# EasyEDA Pro project ProProject_BPF-42_42-front-endpanel.epro

# Board PCB1
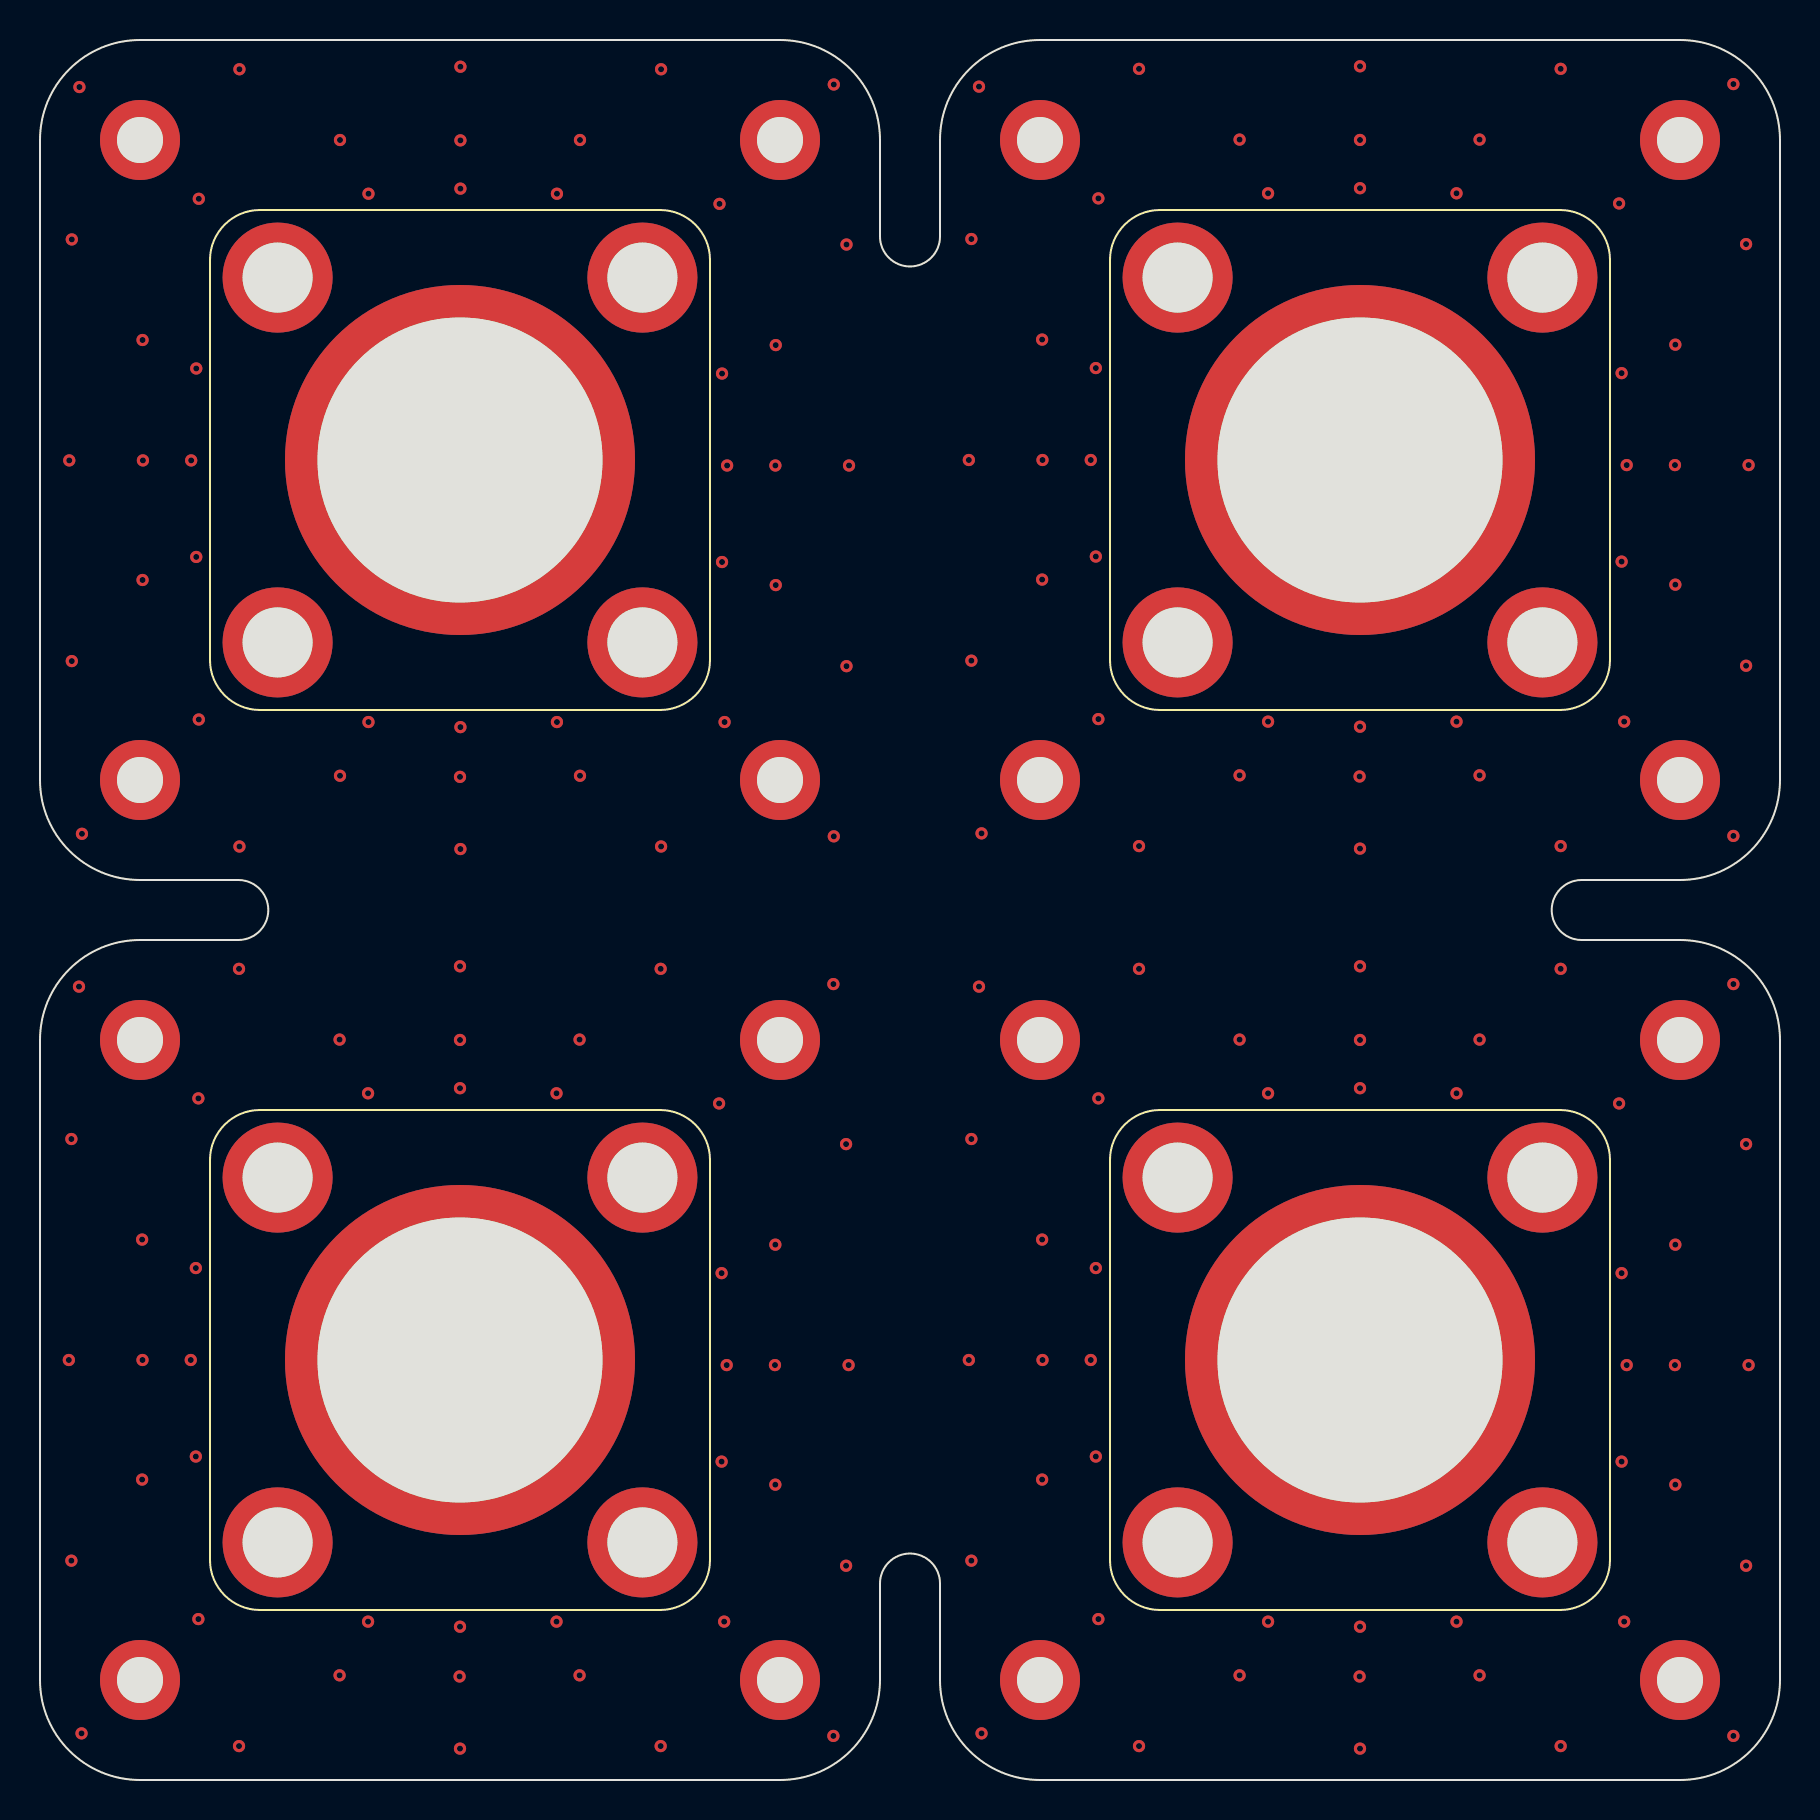
[diagram p0: board, top side]
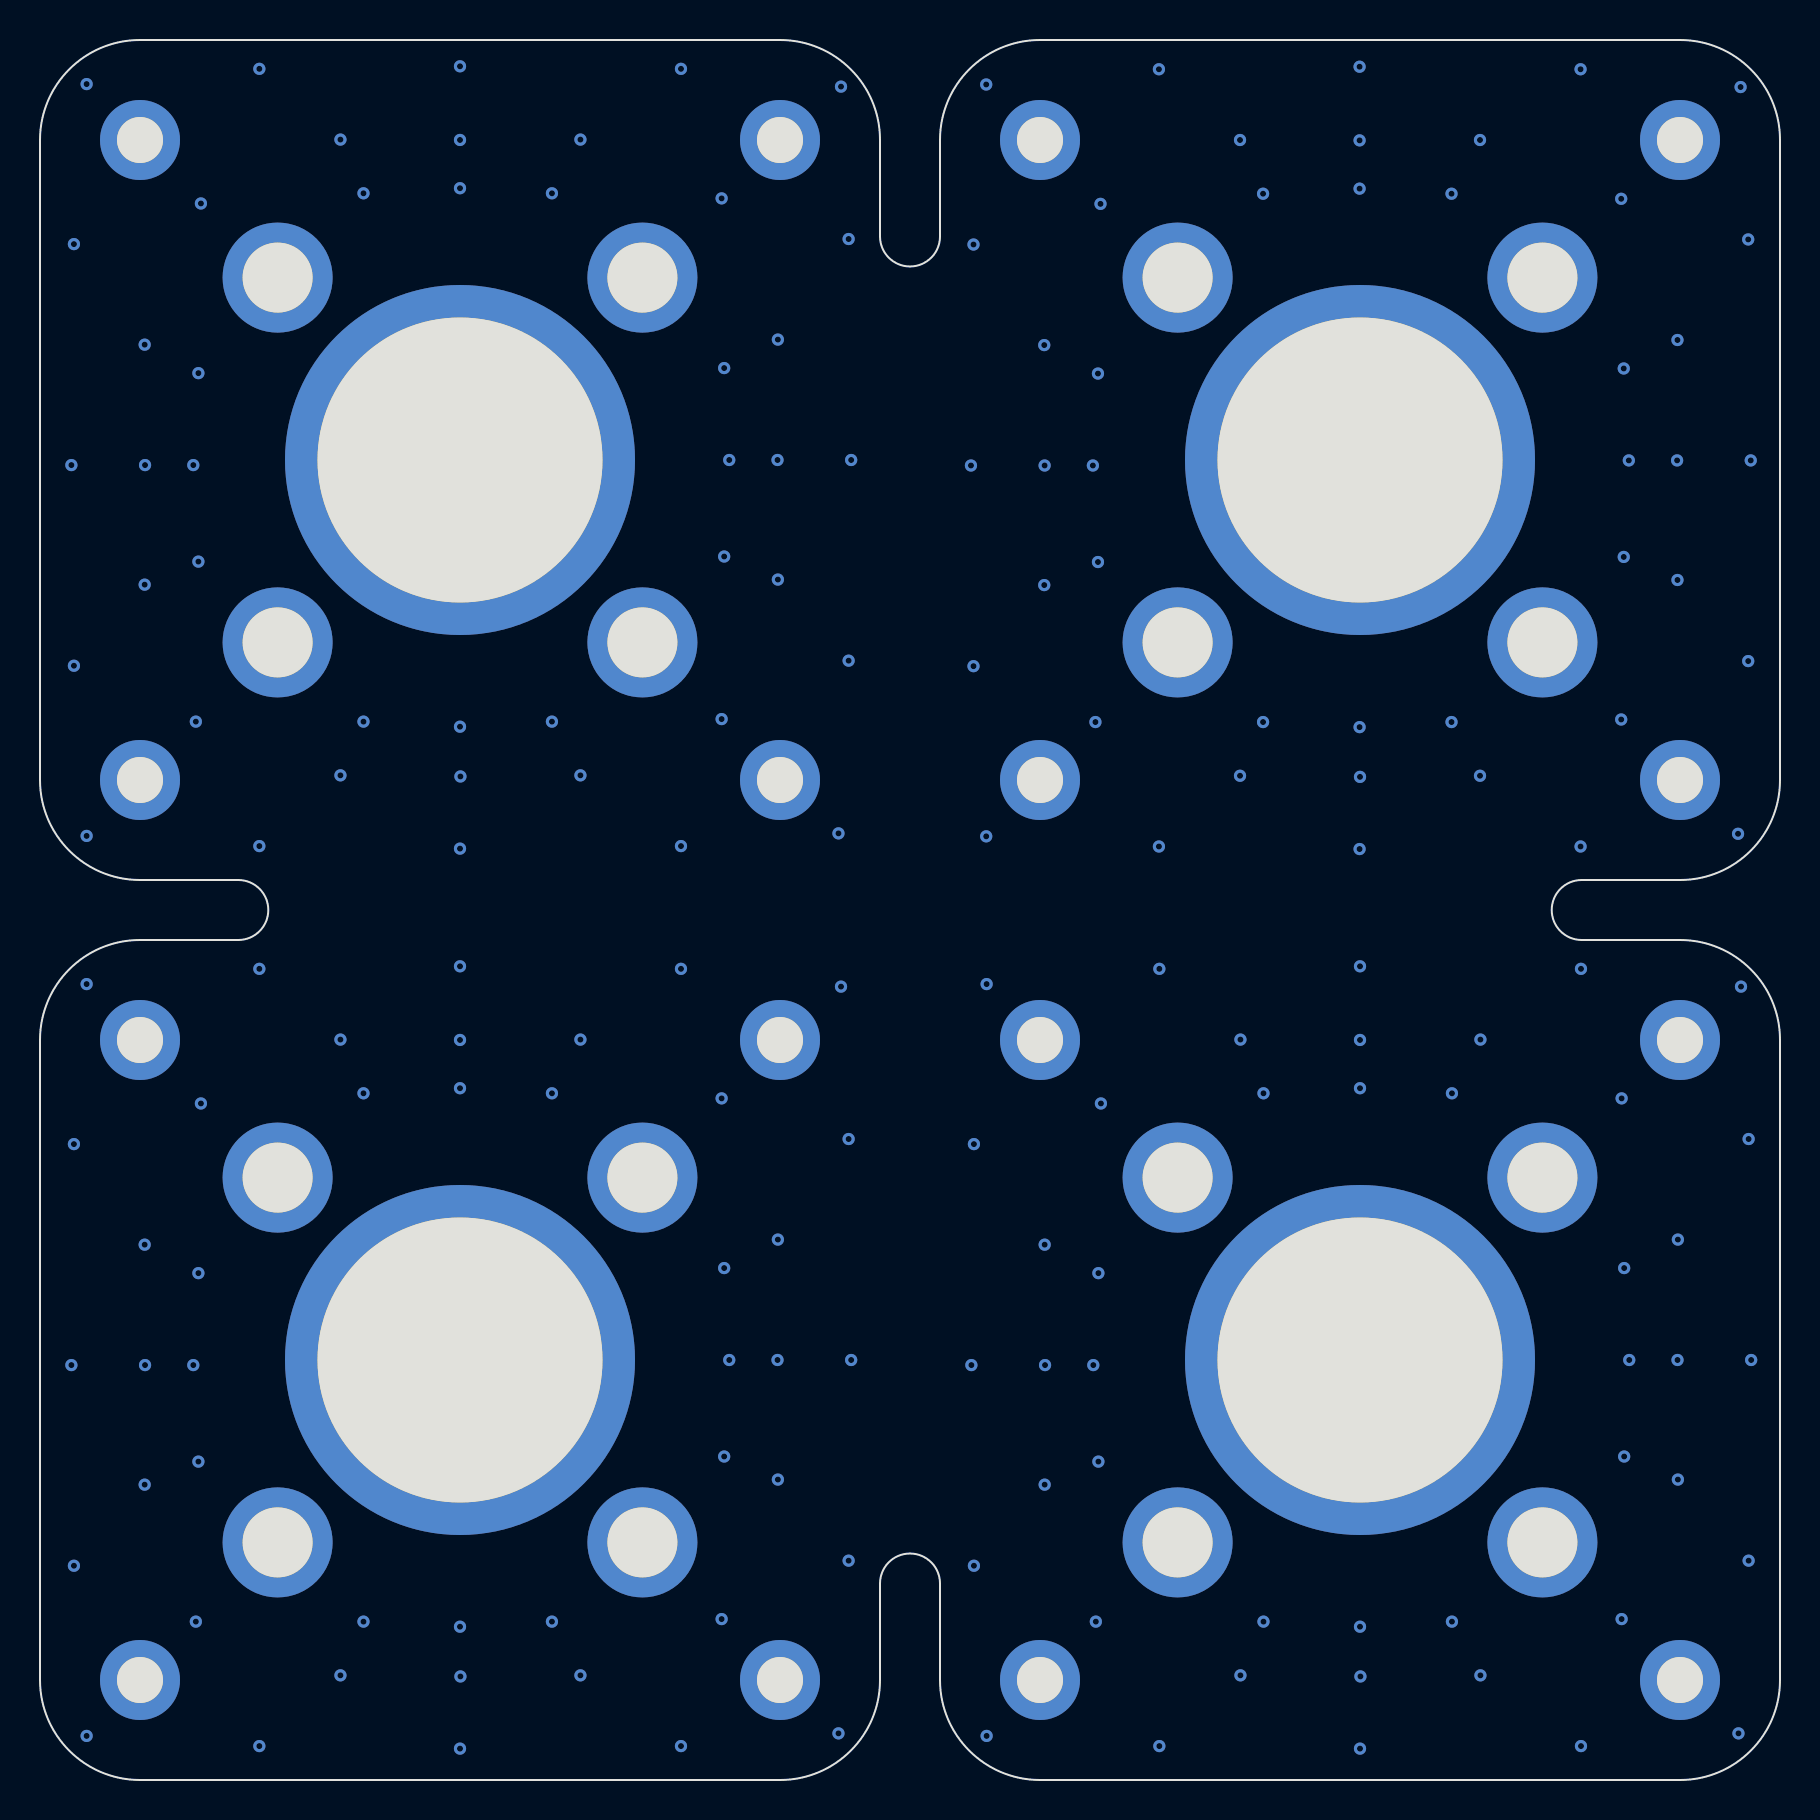
[diagram p1: board, bottom side, seen from below]

Outline 87 x 87 mm; copper layers: Top Layer, Bottom Layer. Coordinates in mm from the lower left corner of the outline.
Outline path: 0,82 arc(1.46,85.54) 5,87 37,87 arc(40.54,85.54) 42,82 42,77.18 arc(43.5,75.68) 45,77.18 45,82 arc(46.46,85.54) 50,87 82,87 arc(85.54,85.54) 87,82 87,50 arc(85.54,46.46) 82,45 77.09,45 arc(75.59,43.5) 77.09,42 82,42 arc(85.54,40.54) 87,37 87,5 arc(85.54,1.46) 82,0 50,0 arc(46.46,1.46) 45,5 45,9.82 arc(43.5,11.32) 42,9.82 42,5 arc(40.54,1.46) 37,0 5,0 arc(1.46,1.46) 0,5 0,37 arc(1.46,40.54) 5,42 9.91,42 arc(11.41,43.5) 9.91,45 5,45 arc(1.46,46.46) 0,50 0,82
Stack: Top Layer 0.035mm / Dielectric1 1.51mm FR4 er 4.5 / Bottom Layer 0.035mm

## Design rules (mm)
template: 自定义配置
spacing copperThickness1oz (default): track to track 0.102, other pairs 0.152 to 0.3
spacing copperThickness2oz: track to track 0.203, other pairs 0.152 to 0.3
track width copperThickness1oz (default): min 0.127, default 0.254, max 10
track width copperThickness2oz: min 0.203, default 0.254, max 2.54
differential pair differentialPair (default): width min 0.127, default 0.254, max 2.54; gap min 0.152, default 0.152
via viaSize (default): diameter min 0.5, default 0.61, max 10; hole min 0.3, default 0.305, max 6.3

## Placement (name value [footprint] x y rotation side)
NOREF  -  [Pad_e232]  75.12 11.88 0 top
NOREF#2  -  [Pad_e217]  37 82 0 top
NOREF#3  -  [Pad_e223]  75.12 75.12 0 top
NOREF#4  -  [Pad_e241]  11.88 11.88 0 top
NOREF#5  -  [Pad_e225]  56.88 56.88 0 top
NOREF#6  -  [Pad_e234]  50 5 0 top
NOREF#7  -  [Pad_e240]  30.12 11.88 0 top
NOREF#8  -  [Pad_e249]  21 21 0 top
NOREF#9  -  [Pad_e237]  5 37 0 top
NOREF#10  -  [Pad_e218]  37 50 0 top
NOREF#11  -  [Pad_e230]  56.88 30.12 0 top
NOREF#12  -  [Pad_e220]  21 66 0 top
NOREF#13  -  [Pad_e246]  82 37 0 top
NOREF#14  -  [Pad_e222]  56.88 75.12 0 top
NOREF#15  -  [Pad_e229]  50 37 0 top
NOREF#16  -  [Pad_e242]  5 5 0 top
NOREF#17  -  [Pad_e214]  11.88 56.88 0 top
NOREF#18  -  [Pad_e213]  30.12 75.12 0 top
NOREF#19  -  [Pad_e226]  50 50 0 top
NOREF#20  -  [Pad_e245]  82 82 0 top
NOREF#21  -  [Pad_e219]  5 50 0 top
NOREF#22  -  [Pad_e247]  37 37 0 top
NOREF#23  -  [Pad_e239]  30.12 30.12 0 top
NOREF#24  -  [Pad_e224]  75.12 56.88 0 top
NOREF#25  -  [Pad_e238]  11.88 30.12 0 top
NOREF#26  -  [Pad_e231]  75.12 30.12 0 top
NOREF#27  -  [Pad_e212]  11.88 75.12 0 top
NOREF#28  -  [Pad_e243]  37 5 0 top
NOREF#29  -  [Pad_e250]  66 21 0 top
NOREF#30  -  [Pad_e235]  82 5 0 top
NOREF#31  -  [Pad_e233]  56.88 11.88 0 top
NOREF#32  -  [Pad_e221]  50 82 0 top
NOREF#33  -  [Pad_e227]  82 50 0 top
NOREF#34  -  [Pad_e248]  66 66 0 top
NOREF#35  -  [Pad_e215]  30.12 56.88 0 top
NOREF#36  -  [Pad_e216]  5 82 0 top

## Footprints (pads in the part's own frame, mm; a bottom-side part is the same pattern mirrored in y, then rotated)
Pad_e212
  round 5.5 hole 3.5: 1(0,0)
Pad_e213
  round 5.5 hole 3.5: 1(0,0)
Pad_e214
  round 5.5 hole 3.5: 1(0,0)
Pad_e215
  round 5.5 hole 3.5: 1(0,0)
Pad_e216
  round 4 hole 2.3: 1(0,0)
Pad_e217
  round 4 hole 2.3: 1(0,0)
Pad_e218
  round 4 hole 2.3: 1(0,0)
Pad_e219
  round 4 hole 2.3: 1(0,0)
Pad_e220
  round 17.5 hole 14.25: 1(0,0)
Pad_e221
  round 4 hole 2.3: 1(0,0)
Pad_e222
  round 5.5 hole 3.5: 1(0,0)
Pad_e223
  round 5.5 hole 3.5: 1(0,0)
Pad_e224
  round 5.5 hole 3.5: 1(0,0)
Pad_e225
  round 5.5 hole 3.5: 1(0,0)
Pad_e226
  round 4 hole 2.3: 1(0,0)
Pad_e227
  round 4 hole 2.3: 1(0,0)
Pad_e229
  round 4 hole 2.3: 1(0,0)
Pad_e230
  round 5.5 hole 3.5: 1(0,0)
Pad_e231
  round 5.5 hole 3.5: 1(0,0)
Pad_e232
  round 5.5 hole 3.5: 1(0,0)
Pad_e233
  round 5.5 hole 3.5: 1(0,0)
Pad_e234
  round 4 hole 2.3: 1(0,0)
Pad_e235
  round 4 hole 2.3: 1(0,0)
Pad_e237
  round 4 hole 2.3: 1(0,0)
Pad_e238
  round 5.5 hole 3.5: 1(0,0)
Pad_e239
  round 5.5 hole 3.5: 1(0,0)
Pad_e240
  round 5.5 hole 3.5: 1(0,0)
Pad_e241
  round 5.5 hole 3.5: 1(0,0)
Pad_e242
  round 4 hole 2.3: 1(0,0)
Pad_e243
  round 4 hole 2.3: 1(0,0)
Pad_e245
  round 4 hole 2.3: 1(0,0)
Pad_e246
  round 4 hole 2.3: 1(0,0)
Pad_e247
  round 4 hole 2.3: 1(0,0)
Pad_e248
  round 17.5 hole 14.25: 1(0,0)
Pad_e249
  round 17.5 hole 14.25: 1(0,0)
Pad_e250
  round 17.5 hole 14.25: 1(0,0)

## Nets
GND: NOREF.1 NOREF#2.1 NOREF#3.1 NOREF#4.1 NOREF#5.1 NOREF#6.1 NOREF#7.1 NOREF#9.1 NOREF#10.1 NOREF#11.1 NOREF#13.1 NOREF#14.1 NOREF#15.1 NOREF#16.1 NOREF#17.1 NOREF#18.1 NOREF#19.1 NOREF#20.1 NOREF#21.1 NOREF#22.1 NOREF#23.1 NOREF#24.1 NOREF#25.1 NOREF#26.1 NOREF#27.1 NOREF#28.1 NOREF#30.1 NOREF#31.1 NOREF#32.1 NOREF#33.1 NOREF#35.1 NOREF#36.1

Pads without a net: NOREF#8 1; NOREF#12 1; NOREF#29 1; NOREF#34 1

## Via types
v1: diameter 0.61, hole 0.305, Top Layer to Bottom Layer, 176 vias

## Routing (per net, layer and track width the routed paths; a pad name or vN(x,y) marks a point on that pad's centre or on a via; arc(x,y) is an arc through that point)
GND:
  vias: v1(1.46,65.98) v1(1.44,21) v1(1.57,32.05) v1(1.57,10.97) v1(1.59,77.03) v1(1.59,55.95) v1(1.97,84.65) v1(1.95,39.67) v1(2.1,47.31) v1(2.08,2.33) v1(5.13,72) v1(5.15,65.98) v1(5.13,60) v1(5.11,27.02) v1(5.12,21) v1(5.11,15.02) v1(7.56,65.98) v1(7.54,21) v1(7.81,70.58) v1(7.81,61.15) v1(7.79,25.6) v1(7.79,16.17) v1(7.94,79.06) v1(7.94,53.02) v1(7.92,34.08) v1(7.92,8.05) v1(9.95,40.56) v1(9.95,1.7) v1(9.97,85.54) v1(9.97,46.67) v1(15,82) v1(15,50.21) v1(14.98,37.02) v1(14.98,5.23) v1(16.42,79.31) v1(16.42,52.9) v1(16.4,34.33) v1(16.4,7.92) v1(21.02,85.66) v1(21.02,81.98) v1(21.02,79.57) v1(21.02,52.64) v1(21,50.16) v1(21.02,46.55) v1(21,40.68) v1(21,37) v1(21,34.59) v1(21,7.66) v1(20.98,5.18) v1(21,1.57) v1(25.85,79.31) v1(25.85,52.9) v1(25.83,34.33) v1(25.83,7.92) v1(27,82) v1(27,50.21) v1(26.98,37.02) v1(26.98,5.23) v1(31.05,85.54) v1(31.05,46.67) v1(31.03,40.56) v1(31.03,1.7) v1(33.95,33.83) v1(33.98,78.81) v1(34.1,70.32) v1(34.1,60.9) v1(34.08,25.34) v1(34.08,15.92) v1(34.23,52.9) v1(34.21,7.92) v1(34.36,65.72) v1(34.33,20.75) v1(36.77,65.72) v1(36.77,26.77) v1(36.75,20.75) v1(36.77,14.77) v1(36.79,71.75) v1(36.79,59.75) v1(39.67,39.8) v1(39.67,2.2) v1(39.69,84.77) v1(39.69,47.18) v1(40.33,76.77) v1(40.33,55.69) v1(40.3,31.79) v1(40.3,10.71) v1(40.45,65.72) v1(40.43,20.75) v1(46.44,66) v1(46.44,21) v1(46.57,77.05) v1(46.57,55.97) v1(46.57,32.05) v1(46.57,10.97) v1(46.95,84.67) v1(46.95,39.67) v1(47.08,47.33) v1(47.08,2.33) v1(50.11,72.02) v1(50.13,66) v1(50.11,60.02) v1(50.11,27.02) v1(50.13,21) v1(50.11,15.02) v1(52.54,66) v1(52.54,21) v1(52.79,70.6) v1(52.79,61.17) v1(52.79,25.6) v1(52.79,16.17) v1(52.92,79.08) v1(52.92,53.05) v1(52.92,34.08) v1(52.92,8.05) v1(54.95,85.56) v1(54.95,46.7) v1(54.95,40.56) v1(54.95,1.7) v1(59.98,82.02) v1(59.98,50.23) v1(59.98,37.02) v1(59.98,5.23) v1(61.4,79.33) v1(61.4,52.92) v1(61.4,34.33) v1(61.4,7.92) v1(66,85.69) v1(66,82) v1(66,79.59) v1(66,52.66) v1(65.98,50.18) v1(66,46.57) v1(66,40.68) v1(66,37) v1(66,34.59) v1(66,7.66) v1(65.98,5.18) v1(66,1.57) v1(70.83,79.33) v1(70.83,52.92) v1(70.83,34.33) v1(70.83,7.92) v1(71.98,82.02) v1(71.98,50.23) v1(71.98,37.02) v1(71.98,5.23) v1(76.03,85.56) v1(76.03,46.7) v1(76.03,40.56) v1(76.03,1.7) v1(78.95,78.83) v1(78.95,33.83) v1(79.08,70.34) v1(79.08,60.92) v1(79.08,25.34) v1(79.08,15.92) v1(79.21,52.92) v1(79.21,7.92) v1(79.33,65.75) v1(79.33,20.75) v1(81.77,71.77) v1(81.75,65.75) v1(81.77,59.77) v1(81.77,26.77) v1(81.75,20.75) v1(81.77,14.77) v1(84.67,84.8) v1(84.67,47.2) v1(84.67,39.8) v1(84.67,2.2) v1(85.3,76.79) v1(85.3,55.71) v1(85.3,31.79) v1(85.3,10.71) v1(85.43,65.75) v1(85.43,20.75)

## Copper pours and planes (outline as drawn; the poured copper is in the pictures)
GND on Top Layer: -4,88.84 92.27,88.84 92.27,-0.82 -4,-0.82
GND on Bottom Layer: -4,88.84 92.27,88.84 92.27,-0.82 -4,-0.82
